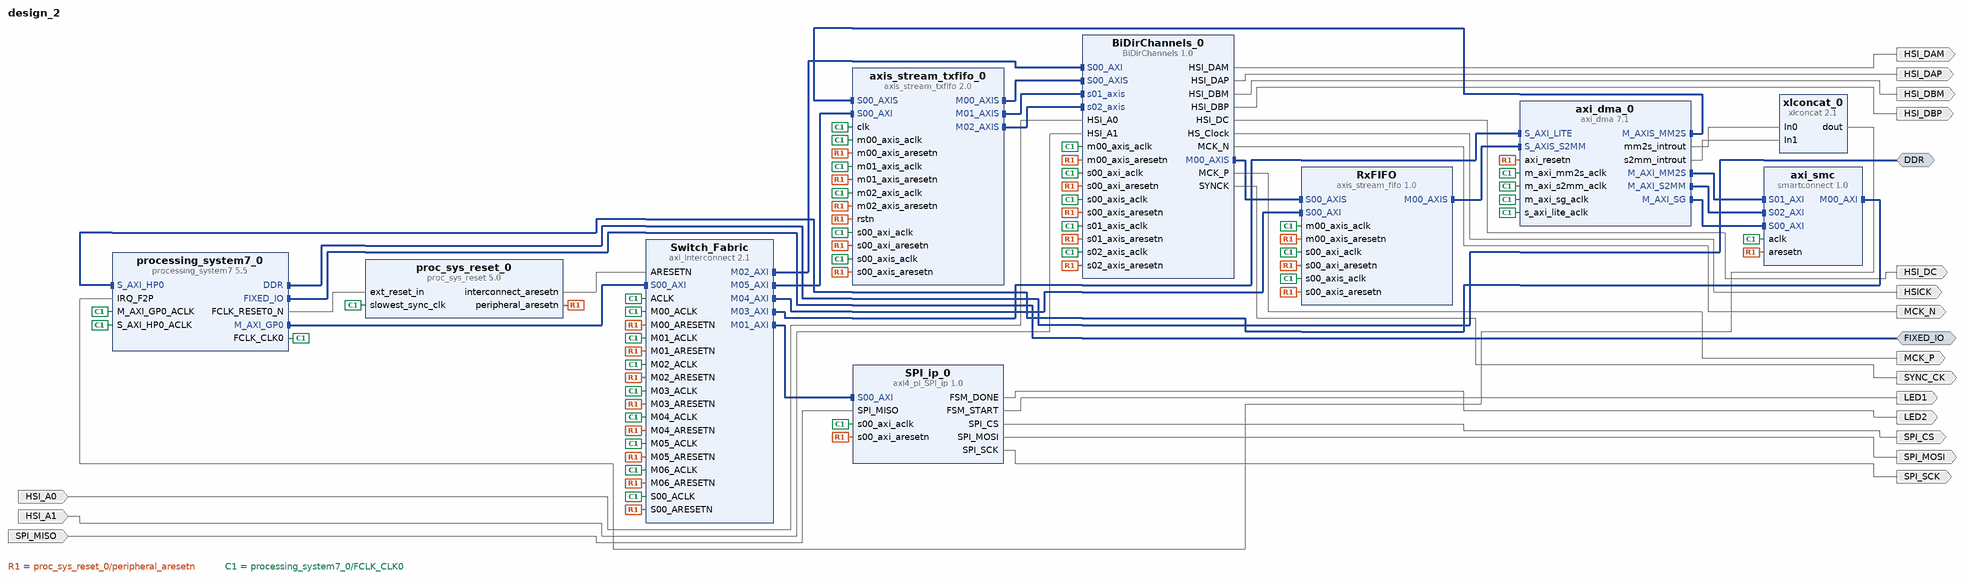
[diagram p0: block diagram of the top level]
# Vivado block design design_2, xc7z020clg484-1, Vivado 2021.2
create_bd_design design_2

create_bd_intf_port -mode Master -vlnv xilinx.com:interface:ddrx_rtl:1.0 DDR
create_bd_intf_port -mode Master -vlnv xilinx.com:display_processing_system7:fixedio_rtl:1.0 FIXED_IO
create_bd_port -dir I -type data SPI_MISO
create_bd_port -dir O -type data SPI_MOSI
create_bd_port -dir O -type data SPI_SCK
create_bd_port -dir O -type data SPI_CS
create_bd_port -dir O -type data LED1
create_bd_port -dir O -type data LED2
create_bd_port -dir O -type data HSICK
create_bd_port -dir O -type data MCK_P
create_bd_port -dir O -type data MCK_N
create_bd_port -dir I -type data HSI_A0
create_bd_port -dir I -type data HSI_A1
create_bd_port -dir O -type data HSI_DAP
create_bd_port -dir O -type data HSI_DAM
create_bd_port -dir O -type data HSI_DBM
create_bd_port -dir O -type data HSI_DBP
create_bd_port -dir O -type data HSI_DC
create_bd_port -dir O -type data SYNC_CK

create_bd_cell -type ip -vlnv xilinx.com:user:axi4_pl_SPI_ip:1.0 SPI_ip_0
create_bd_cell -type ip -vlnv xilinx.com:user:axis_stream_fifo:1.0 RxFIFO
set_property -dict {CONFIG.ADDR_WIDTH 12} [get_bd_cells RxFIFO]
create_bd_cell -type ip -vlnv xilinx.com:user:BiDirChannels:1.0 BiDirChannels_0
create_bd_cell -type ip -vlnv user.org:user:axis_stream_txfifo:2.0 axis_stream_txfifo_0
set_property -dict {CONFIG.ADDR_WIDTH 11} [get_bd_cells axis_stream_txfifo_0]
create_bd_cell -type ip -vlnv xilinx.com:ip:axi_interconnect:2.1 Switch_Fabric
set_property -dict {CONFIG.NUM_MI 7} [get_bd_cells Switch_Fabric]
create_bd_cell -type ip -vlnv xilinx.com:ip:axi_dma:7.1 axi_dma_0
set_property -dict {CONFIG.c_sg_include_stscntrl_strm 0} [get_bd_cells axi_dma_0]
create_bd_cell -type ip -vlnv xilinx.com:ip:xlconcat:2.1 xlconcat_0
set_property -dict {CONFIG.NUM_PORTS 5 CONFIG.dout_width 5} [get_bd_cells xlconcat_0]
create_bd_cell -type ip -vlnv xilinx.com:ip:smartconnect:1.0 axi_smc
set_property -dict {CONFIG.NUM_SI 3} [get_bd_cells axi_smc]
create_bd_cell -type ip -vlnv xilinx.com:ip:processing_system7:5.5 processing_system7_0
set_property -dict [list \
  CONFIG.PCW_APU_PERIPHERAL_FREQMHZ 666.666667 \
  CONFIG.PCW_ENET0_ENET0_IO {MIO 16 .. 27} \
  CONFIG.PCW_ENET0_GRP_MDIO_ENABLE 1 \
  CONFIG.PCW_ENET0_GRP_MDIO_IO {MIO 52 .. 53} \
  CONFIG.PCW_ENET0_PERIPHERAL_ENABLE 1 \
  CONFIG.PCW_ENET0_RESET_ENABLE 0 \
  CONFIG.PCW_ENET_RESET_ENABLE 1 \
  CONFIG.PCW_ENET_RESET_SELECT {Share reset pin} \
  CONFIG.PCW_FPGA0_PERIPHERAL_FREQMHZ 100.000000 \
  CONFIG.PCW_FPGA1_PERIPHERAL_FREQMHZ 150.000000 \
  CONFIG.PCW_GPIO_MIO_GPIO_ENABLE 1 \
  CONFIG.PCW_GPIO_MIO_GPIO_IO MIO \
  CONFIG.PCW_I2C_RESET_ENABLE 1 \
  CONFIG.PCW_IRQ_F2P_INTR 1 \
  CONFIG.PCW_PERIPHERAL_BOARD_PRESET part0 \
  CONFIG.PCW_PRESET_BANK1_VOLTAGE {LVCMOS 1.8V} \
  CONFIG.PCW_QSPI_GRP_SINGLE_SS_ENABLE 1 \
  CONFIG.PCW_QSPI_GRP_SINGLE_SS_IO {MIO 1 .. 6} \
  CONFIG.PCW_QSPI_PERIPHERAL_ENABLE 1 \
  CONFIG.PCW_QSPI_QSPI_IO {MIO 1 .. 6} \
  CONFIG.PCW_SD0_GRP_CD_ENABLE 1 \
  CONFIG.PCW_SD0_GRP_CD_IO {MIO 47} \
  CONFIG.PCW_SD0_GRP_WP_ENABLE 1 \
  CONFIG.PCW_SD0_GRP_WP_IO {MIO 46} \
  CONFIG.PCW_SD0_PERIPHERAL_ENABLE 1 \
  CONFIG.PCW_SD0_SD0_IO {MIO 40 .. 45} \
  CONFIG.PCW_SDIO_PERIPHERAL_FREQMHZ 50 \
  CONFIG.PCW_SINGLE_QSPI_DATA_MODE x4 \
  CONFIG.PCW_TTC0_PERIPHERAL_ENABLE 1 \
  CONFIG.PCW_TTC0_TTC0_IO EMIO \
  CONFIG.PCW_UART1_PERIPHERAL_ENABLE 1 \
  CONFIG.PCW_UART1_UART1_IO {MIO 48 .. 49} \
  CONFIG.PCW_UART_PERIPHERAL_FREQMHZ 50 \
  CONFIG.PCW_UIPARAM_DDR_FREQ_MHZ 533.333313 \
  CONFIG.PCW_UIPARAM_DDR_PARTNO {MT41J128M16 HA-15E} \
  CONFIG.PCW_USB0_PERIPHERAL_ENABLE 1 \
  CONFIG.PCW_USB0_RESET_ENABLE 0 \
  CONFIG.PCW_USB0_USB0_IO {MIO 28 .. 39} \
  CONFIG.PCW_USB_RESET_ENABLE 1 \
  CONFIG.PCW_USB_RESET_SELECT {Share reset pin} \
  CONFIG.PCW_USE_FABRIC_INTERRUPT 1 \
  CONFIG.PCW_USE_S_AXI_HP0 1 \
  CONFIG.preset ZedBoard \
] [get_bd_cells processing_system7_0]
# 513 more settings of processing_system7_0 are not shown: defaults, MIO pin electricals, DDR timing, and values the tool derives
create_bd_cell -type ip -vlnv xilinx.com:ip:proc_sys_reset:5.0 proc_sys_reset_0

# ---- connections ----

connect_bd_intf_net [get_bd_intf_pins BiDirChannels_0/M00_AXIS] [get_bd_intf_pins RxFIFO/S00_AXIS]
connect_bd_intf_net [get_bd_intf_pins axis_stream_txfifo_0/S00_AXIS] [get_bd_intf_pins axi_dma_0/M_AXIS_MM2S]
connect_bd_intf_net [get_bd_intf_pins axi_dma_0/M_AXI_MM2S] [get_bd_intf_pins axi_smc/S01_AXI]
connect_bd_intf_net [get_bd_intf_pins axi_dma_0/M_AXI_S2MM] [get_bd_intf_pins axi_smc/S02_AXI]
connect_bd_intf_net [get_bd_intf_pins axi_dma_0/M_AXI_SG] [get_bd_intf_pins axi_smc/S00_AXI]
connect_bd_intf_net [get_bd_intf_pins axi_smc/M00_AXI] [get_bd_intf_pins processing_system7_0/S_AXI_HP0]
connect_bd_intf_net -intf_net axis_stream_fifo_0_M00_AXIS [get_bd_intf_pins RxFIFO/M00_AXIS] [get_bd_intf_pins axi_dma_0/S_AXIS_S2MM]
connect_bd_intf_net [get_bd_intf_pins axis_stream_txfifo_0/M00_AXIS] [get_bd_intf_pins BiDirChannels_0/S00_AXIS]
connect_bd_intf_net [get_bd_intf_pins axis_stream_txfifo_0/M01_AXIS] [get_bd_intf_pins BiDirChannels_0/s01_axis]
connect_bd_intf_net [get_bd_intf_pins BiDirChannels_0/s02_axis] [get_bd_intf_pins axis_stream_txfifo_0/M02_AXIS]
connect_bd_intf_net [get_bd_intf_ports DDR] [get_bd_intf_pins processing_system7_0/DDR]
connect_bd_intf_net [get_bd_intf_ports FIXED_IO] [get_bd_intf_pins processing_system7_0/FIXED_IO]
connect_bd_intf_net [get_bd_intf_pins processing_system7_0/M_AXI_GP0] [get_bd_intf_pins Switch_Fabric/S00_AXI]
connect_bd_intf_net [get_bd_intf_pins Switch_Fabric/M01_AXI] [get_bd_intf_pins SPI_ip_0/S00_AXI]
connect_bd_intf_net [get_bd_intf_pins Switch_Fabric/M02_AXI] [get_bd_intf_pins BiDirChannels_0/S00_AXI]
connect_bd_intf_net [get_bd_intf_pins Switch_Fabric/M03_AXI] [get_bd_intf_pins axi_dma_0/S_AXI_LITE]
connect_bd_intf_net [get_bd_intf_pins Switch_Fabric/M04_AXI] [get_bd_intf_pins RxFIFO/S00_AXI]
connect_bd_intf_net [get_bd_intf_pins axis_stream_txfifo_0/S00_AXI] [get_bd_intf_pins Switch_Fabric/M05_AXI]
connect_bd_net [get_bd_pins BiDirChannels_0/HSI_DAM] [get_bd_ports HSI_DAM]
connect_bd_net [get_bd_pins BiDirChannels_0/HSI_DAP] [get_bd_ports HSI_DAP]
connect_bd_net [get_bd_pins BiDirChannels_0/HSI_DBM] [get_bd_ports HSI_DBM]
connect_bd_net [get_bd_pins BiDirChannels_0/HSI_DBP] [get_bd_ports HSI_DBP]
connect_bd_net [get_bd_pins BiDirChannels_0/HSI_DC] [get_bd_ports HSI_DC]
connect_bd_net [get_bd_pins BiDirChannels_0/HS_Clock] [get_bd_ports HSICK]
connect_bd_net [get_bd_pins BiDirChannels_0/MCK_N] [get_bd_ports MCK_N]
connect_bd_net [get_bd_pins BiDirChannels_0/MCK_P] [get_bd_ports MCK_P]
connect_bd_net [get_bd_pins BiDirChannels_0/SYNCK] [get_bd_ports SYNC_CK]
connect_bd_net -net HSI_A0_1 [get_bd_ports HSI_A0] [get_bd_pins BiDirChannels_0/HSI_A0]
connect_bd_net -net HSI_A1_1 [get_bd_ports HSI_A1] [get_bd_pins BiDirChannels_0/HSI_A1]
connect_bd_net [get_bd_ports SPI_MISO] [get_bd_pins SPI_ip_0/SPI_MISO]
connect_bd_net [get_bd_pins SPI_ip_0/FSM_DONE] [get_bd_ports LED2]
connect_bd_net [get_bd_pins SPI_ip_0/FSM_START] [get_bd_ports LED1]
connect_bd_net [get_bd_pins SPI_ip_0/SPI_CS] [get_bd_ports SPI_CS]
connect_bd_net [get_bd_pins SPI_ip_0/SPI_MOSI] [get_bd_ports SPI_MOSI]
connect_bd_net [get_bd_pins SPI_ip_0/SPI_SCK] [get_bd_ports SPI_SCK]
connect_bd_net [get_bd_pins axi_dma_0/mm2s_introut] [get_bd_pins xlconcat_0/In0]
connect_bd_net [get_bd_pins axi_dma_0/s2mm_introut] [get_bd_pins xlconcat_0/In1]
connect_bd_net [get_bd_pins proc_sys_reset_0/interconnect_aresetn] [get_bd_pins Switch_Fabric/ARESETN]
connect_bd_net [get_bd_pins proc_sys_reset_0/peripheral_aresetn] \
  [get_bd_pins Switch_Fabric/S00_ARESETN] [get_bd_pins Switch_Fabric/M00_ARESETN] [get_bd_pins Switch_Fabric/M01_ARESETN] \
  [get_bd_pins Switch_Fabric/M02_ARESETN] [get_bd_pins Switch_Fabric/M03_ARESETN] [get_bd_pins Switch_Fabric/M04_ARESETN] \
  [get_bd_pins Switch_Fabric/M05_ARESETN] [get_bd_pins Switch_Fabric/M06_ARESETN] [get_bd_pins RxFIFO/s00_axis_aresetn] \
  [get_bd_pins RxFIFO/m00_axis_aresetn] [get_bd_pins RxFIFO/s00_axi_aresetn] [get_bd_pins axi_dma_0/axi_resetn] \
  [get_bd_pins axi_smc/aresetn] [get_bd_pins axis_stream_txfifo_0/s00_axis_aresetn] \
  [get_bd_pins axis_stream_txfifo_0/m02_axis_aresetn] [get_bd_pins axis_stream_txfifo_0/s00_axi_aresetn] \
  [get_bd_pins axis_stream_txfifo_0/m00_axis_aresetn] [get_bd_pins axis_stream_txfifo_0/m01_axis_aresetn] \
  [get_bd_pins axis_stream_txfifo_0/rstn] [get_bd_pins BiDirChannels_0/s00_axis_aresetn] \
  [get_bd_pins BiDirChannels_0/s02_axis_aresetn] [get_bd_pins BiDirChannels_0/s01_axis_aresetn] \
  [get_bd_pins BiDirChannels_0/m00_axis_aresetn] [get_bd_pins BiDirChannels_0/s00_axi_aresetn] \
  [get_bd_pins SPI_ip_0/s00_axi_aresetn]
connect_bd_net [get_bd_pins processing_system7_0/FCLK_CLK0] \
  [get_bd_pins SPI_ip_0/s00_axi_aclk] [get_bd_pins RxFIFO/s00_axi_aclk] [get_bd_pins RxFIFO/m00_axis_aclk] \
  [get_bd_pins RxFIFO/s00_axis_aclk] [get_bd_pins BiDirChannels_0/s00_axi_aclk] [get_bd_pins BiDirChannels_0/m00_axis_aclk] \
  [get_bd_pins BiDirChannels_0/s01_axis_aclk] [get_bd_pins BiDirChannels_0/s02_axis_aclk] \
  [get_bd_pins BiDirChannels_0/s00_axis_aclk] [get_bd_pins axis_stream_txfifo_0/clk] \
  [get_bd_pins axis_stream_txfifo_0/m01_axis_aclk] [get_bd_pins axis_stream_txfifo_0/m00_axis_aclk] \
  [get_bd_pins axis_stream_txfifo_0/s00_axi_aclk] [get_bd_pins axis_stream_txfifo_0/m02_axis_aclk] \
  [get_bd_pins axis_stream_txfifo_0/s00_axis_aclk] [get_bd_pins Switch_Fabric/ACLK] [get_bd_pins Switch_Fabric/S00_ACLK] \
  [get_bd_pins Switch_Fabric/M00_ACLK] [get_bd_pins Switch_Fabric/M01_ACLK] [get_bd_pins Switch_Fabric/M02_ACLK] \
  [get_bd_pins Switch_Fabric/M03_ACLK] [get_bd_pins Switch_Fabric/M04_ACLK] [get_bd_pins Switch_Fabric/M05_ACLK] \
  [get_bd_pins Switch_Fabric/M06_ACLK] [get_bd_pins axi_dma_0/s_axi_lite_aclk] [get_bd_pins axi_dma_0/m_axi_sg_aclk] \
  [get_bd_pins axi_dma_0/m_axi_mm2s_aclk] [get_bd_pins axi_dma_0/m_axi_s2mm_aclk] [get_bd_pins axi_smc/aclk] \
  [get_bd_pins processing_system7_0/M_AXI_GP0_ACLK] [get_bd_pins processing_system7_0/S_AXI_HP0_ACLK] \
  [get_bd_pins proc_sys_reset_0/slowest_sync_clk]
connect_bd_net [get_bd_pins processing_system7_0/FCLK_RESET0_N] [get_bd_pins proc_sys_reset_0/ext_reset_in]
connect_bd_net [get_bd_pins xlconcat_0/dout] [get_bd_pins processing_system7_0/IRQ_F2P]

# ---- address map ----
assign_bd_address -offset 0x00000000 -range 512M -target_address_space [get_bd_addr_spaces axi_dma_0/Data_MM2S] [get_bd_addr_segs processing_system7_0/S_AXI_HP0/HP0_DDR_LOWOCM]
assign_bd_address -offset 0x00000000 -range 512M -target_address_space [get_bd_addr_spaces axi_dma_0/Data_S2MM] [get_bd_addr_segs processing_system7_0/S_AXI_HP0/HP0_DDR_LOWOCM]
assign_bd_address -offset 0x00000000 -range 512M -target_address_space [get_bd_addr_spaces axi_dma_0/Data_SG] [get_bd_addr_segs processing_system7_0/S_AXI_HP0/HP0_DDR_LOWOCM]
assign_bd_address -offset 0x40400000 -range 64K -target_address_space [get_bd_addr_spaces processing_system7_0/Data] [get_bd_addr_segs axi_dma_0/S_AXI_LITE/Reg]
assign_bd_address -offset 0x43C10000 -range 64K -target_address_space [get_bd_addr_spaces processing_system7_0/Data] [get_bd_addr_segs SPI_ip_0/S00_AXI/S00_AXI_reg]
assign_bd_address -offset 0x43C20000 -range 64K -target_address_space [get_bd_addr_spaces processing_system7_0/Data] [get_bd_addr_segs BiDirChannels_0/S00_AXI/S00_AXI_reg]
assign_bd_address -offset 0x43C30000 -range 64K -target_address_space [get_bd_addr_spaces processing_system7_0/Data] [get_bd_addr_segs RxFIFO/S00_AXI/S00_AXI_reg]
assign_bd_address -offset 0x43C40000 -range 64K -target_address_space [get_bd_addr_spaces processing_system7_0/Data] [get_bd_addr_segs axis_stream_txfifo_0/S00_AXI/S00_AXI_reg]

validate_bd_design
save_bd_design
